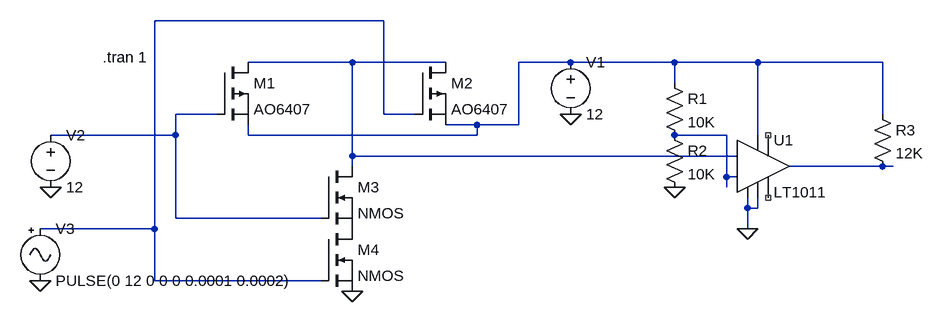
[diagram p0: schematic and gate.asc]
and gate.asc, the LTspice schematic file:
Version 4.1
SHEET 1 880 680
WIRE -16 -304 -368 -304
WIRE -64 -240 -224 -240
WIRE 80 -240 -64 -240
WIRE 272 -240 192 -240
WIRE 432 -240 272 -240
WIRE 560 -240 432 -240
WIRE 752 -240 560 -240
WIRE 432 -208 432 -240
WIRE -272 -160 -336 -160
WIRE -16 -160 -16 -304
WIRE 32 -160 -16 -160
WIRE 752 -160 752 -240
WIRE 128 -144 80 -144
WIRE 192 -144 192 -240
WIRE 192 -144 128 -144
WIRE -336 -128 -336 -160
WIRE -336 -128 -528 -128
WIRE -224 -128 -224 -144
WIRE 128 -128 128 -144
WIRE 128 -128 -224 -128
WIRE 512 -128 432 -128
WIRE 560 -128 560 -240
WIRE -64 -96 -64 -240
WIRE 528 -96 -64 -96
WIRE -64 -80 -64 -96
WIRE 752 -80 608 -80
WIRE 768 -80 752 -80
WIRE 512 -64 512 -128
WIRE 528 -64 512 -64
WIRE 512 -48 512 -64
WIRE 544 -16 544 -32
WIRE 560 -16 560 -32
WIRE 560 -16 544 -16
WIRE -336 0 -336 -128
WIRE -112 0 -336 0
WIRE -368 16 -368 -304
WIRE -368 16 -544 16
WIRE 544 16 544 -16
WIRE -368 96 -368 16
WIRE -112 96 -368 96
FLAG 272 -160 0
FLAG -64 112 0
FLAG -528 -48 0
FLAG -544 96 0
FLAG 544 16 0
FLAG 432 -48 0
SYMBOL pmos 32 -240 R0
SYMATTR InstName M2
SYMATTR Value AO6407
SYMBOL voltage 272 -256 R0
WINDOW 123 0 0 Left 0
WINDOW 39 0 0 Left 0
SYMATTR InstName V1
SYMATTR Value 12
SYMBOL pmos -272 -240 R0
SYMATTR InstName M1
SYMATTR Value AO6407
SYMBOL nmos -112 -80 R0
SYMATTR InstName M3
SYMBOL nmos -112 16 R0
SYMATTR InstName M4
SYMBOL voltage -528 -144 R0
WINDOW 123 0 0 Left 0
WINDOW 39 0 0 Left 0
SYMATTR InstName V2
SYMATTR Value 12
SYMBOL Misc\\signal -544 0 R0
WINDOW 123 0 0 Left 0
WINDOW 39 0 0 Left 0
SYMATTR InstName V3
SYMATTR Value PULSE(0 12 0 0 0 0.0001 0.0002)
SYMBOL Comparators\\LT1011 560 -80 R0
SYMATTR InstName U1
SYMBOL res 416 -224 R0
SYMATTR InstName R1
SYMATTR Value 10K
SYMBOL res 416 -144 R0
SYMATTR InstName R2
SYMATTR Value 10K
SYMBOL res 736 -176 R0
SYMATTR InstName R3
SYMATTR Value 12K
TEXT -448 -248 Left 2 !.tran 1

The netlist it stands for:
* and gate.asc
M2 N002 N001 N003 N003 AO6407
V1 N003 0 12
M1 N002 N004 N003 N003 AO6407
M3 N002 N004 P001 P001 NMOS
M4 P001 N001 0 0 NMOS
V2 N004 0 12
V3 N001 0 PULSE(0 12 0 0 0 0.0001 0.0002)
X§U1 0 N005 N002 0 NC_01 NC_02 N006 N003 LT1011
R1 N003 N005 10K
R2 N005 0 10K
R3 N003 N006 12K
.model NMOS NMOS
.model PMOS PMOS
.lib standard.mos
.tran 1
.lib LTC1.lib
.backanno
.end